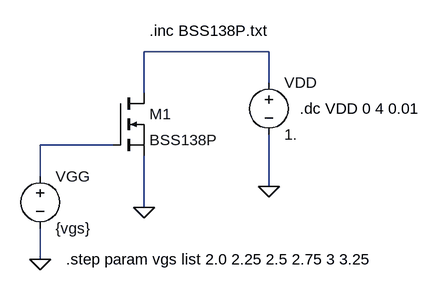
[diagram p0: schematic bss138p_output_characteristics.asc]
bss138p_output_characteristics.asc, the LTspice schematic file:
Version 4.1
SHEET 1 880 680
WIRE 448 16 256 16
WIRE 448 64 448 16
WIRE 256 80 256 16
WIRE 208 160 96 160
WIRE 96 208 96 160
WIRE 448 224 448 144
WIRE 256 256 256 176
WIRE 96 336 96 288
FLAG 256 256 0
FLAG 448 224 0
FLAG 96 336 0
SYMBOL nmos 208 80 R0
SYMATTR InstName M1
SYMATTR Value BSS138P
SYMATTR Prefix X
SYMBOL voltage 96 192 R0
WINDOW 123 0 0 Left 0
WINDOW 39 0 0 Left 0
SYMATTR InstName VGG
SYMATTR Value {vgs}
SYMBOL voltage 448 48 R0
WINDOW 123 0 0 Left 0
WINDOW 39 0 0 Left 0
SYMATTR InstName VDD
SYMATTR Value 1.
TEXT 136 336 Left 2 !.step param vgs list 2.0 2.25 2.5 2.75 3 3.25
TEXT 496 104 Left 2 !.dc VDD 0 4 0.01
TEXT 264 -16 Left 2 !.inc BSS138P.txt

The netlist it stands for:
* bss138p_output_characteristics.asc
X§M1 N001 N002 0 BSS138P  ; pins D G S
VGG N002 0 {vgs}
VDD N001 0 1.
.step param vgs list 2.0 2.25 2.5 2.75 3 3.25
.dc VDD 0 4 0.01
.inc BSS138P.txt
.backanno
.end